# EAGLE design eagle-a31301-breakout-board (EAGLE 9.6.2)
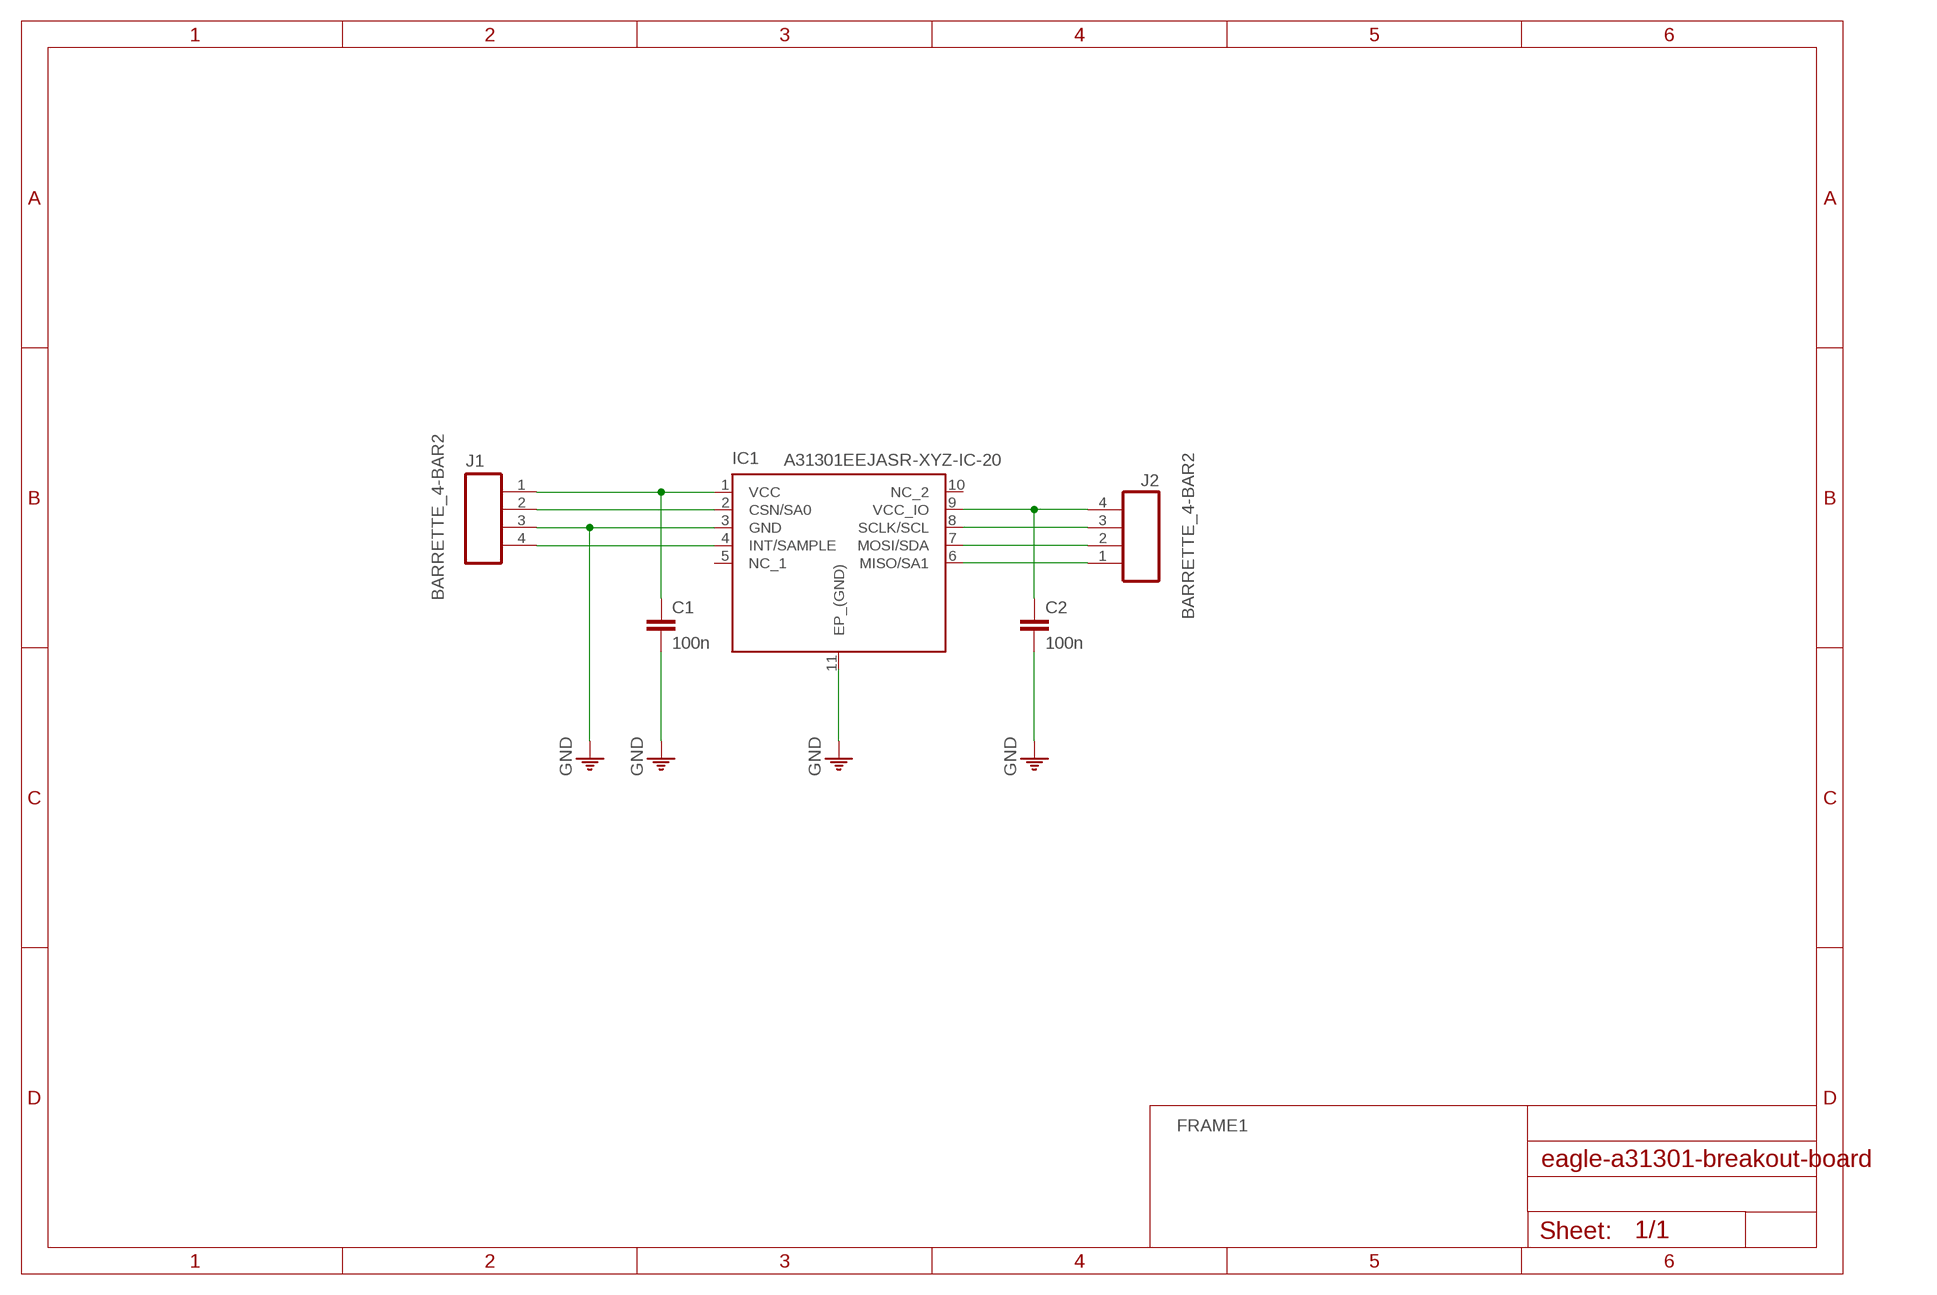
[diagram p0: schematic, sheet 1]

## Parts
C1  100n  C-CMS1206  [CCMS1206]
C2  100n  C-CMS1206  [CCMS1206]
IC1  A31301EEJASR-XYZ-IC-20  [DFN-10]
J1  BARRETTE_4-BAR2  [FE04]
J2  BARRETTE_4-BAR2  [FE04]

## Nets
GND: C1.2 C2.2 IC1.3(GND) IC1.11(EP_(GND)) J1.3
N$1: C1.1 IC1.1(VCC) J1.1
N$2: IC1.2(CSN/SA0) J1.2
N$4: IC1.4(INT/SAMPLE) J1.4
N$5: IC1.6(MISO/SA1) J2.1
N$6: IC1.7(MOSI/SDA) J2.2
N$7: IC1.8(SCLK/SCL) J2.3
N$8: C2.1 IC1.9(VCC_IO) J2.4
Unconnected: IC1.5(NC_1) IC1.10(NC_2)

## Library data of the parts
C1 C2 = 0IUT RLCQ:C: Condensateur non Polarisé, Symbole Européen Voir les valeurs sur site Magasin: http://geii/magasin GEII/IUT ANGERS; MAGASIN: (MAG-CMS)
IC1 = 0IUT xPROJETS:A31301EEJASR-XYZ-IC-20: 3D Linear Hall-Effect Sensor with SPI, I2C Interfaces, and Advanced Low-Power Management Source: Datasheet <https://www.allegromicro.com/en/>; DESCRIPTION: 3D Linear Hall-Effect Sensor with SPI, I2C Interfaces, and Advanced Low-Power Management; HEIGHT: 0.8mm; MANUFACTURER_NAME: Allegro Microsystems; MANUFACTURER_PART_NUMBER: A31301EEJASR-XYZ-IC-20; MOUSER_PART_NUMBER: 250-A31301EEJASRIC20; MOUSER_PRICE-STOCK: https://www.mouser.co.uk/ProductDetail/Allegro-MicroSystems/A31301EEJASR-XYZ-IC-20?qs=ST9lo4GX8V1xABNyek0fqA%3D%3D
J1 J2 = 0IUT CONNECTEURS:BARRETTE_4: Barrette 4 Contacts GEII/IUT ANGERS; MAGASIN: BARRETTES 2 (Tiroirs n°2-8)

## Board
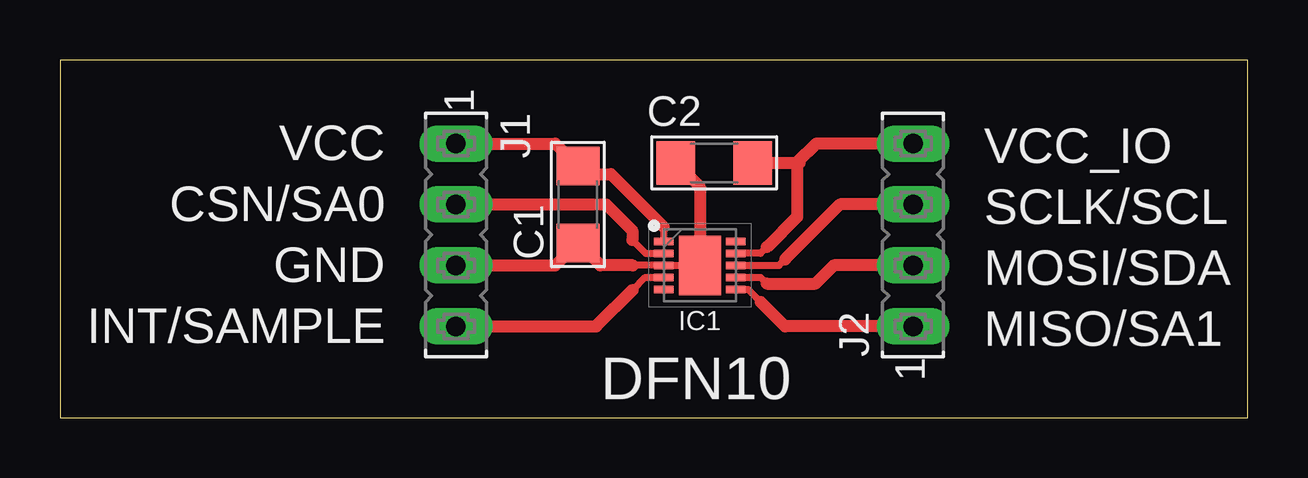
[diagram p1: board, top side]

Size 49.51 x 14.91 mm. Coordinates in mm from the lower left corner, seen from the top.
Outline: 0,0 49.51,0 49.51,14.91 0,14.91 0,0
Copper layers (1*16): Top 0.105mm / dielectric 1.55mm / Bottom 0.105mm
Design rules "default *": minimum track width 0.2mm, minimum drill 0.8mm, track to track 0.2mm, track to pad 0.2mm, pad to pad 0.2mm, via to via 0.2mm, smd to smd 0mil, copper to edge 0mil, drill to drill 0.35mm, minimum pad ring 0.25mm, minimum via ring 0.5mm, stop-mask expansion 0mil, vias tented up to drill 0.45mm, thermal gap 0.2mm

### Footprints (pad centres in the part's own frame; a part is rotated, then mirrored left to right if it is on the bottom)
CCMS1206 = smd 1.6 x 1.803: 1 -1.6,0; 2 1.6,0
DFN-10 = smd 0.8 x 0.3: 1 -1.5,1; 2 -1.5,0.5; 3 -1.5,0; 4 -1.5,-0.5; 5 -1.5,-1; 6 1.5,-1; 7 1.5,-0.5; 8 1.5,0; 9 1.5,0.5; 10 1.5,1 | smd 1.75 x 2.48: 11 0,0
FE04 = drill 0.813 pad 1.524 long: 1 -3.81,0; 2 -1.27,0; 3 1.27,0; 4 3.81,0

### Placement (x,y rotation side)
C1  21.59,8.89 270 top
C2  27.27,10.62 180 top
IC1  26.67,6.35 0 top
J1  16.51,7.62 270 top
J2  35.56,7.62 90 top

### Tracks (layer width: path | path; a pad name or v marks a point on that pad's centre or on a via)
GND
  Top 0.3: IC1.11 IC1.3 23.88,6.35
  Top 0.5: C2.2 26.67,9.62 IC1.11 | 23.88,6.35 22.53,6.35 C1.2 20.65,6.35 J1.3
N$1
  Top 0.3: IC1.1 25.17,7.95
  Top 0.5: 25.17,7.95 22.96,10.16 21.92,10.16 C1.1 20.65,11.43 J1.1
N$2
  Top 0.3: 23.86,7.4 24.41,6.85 IC1.2
  Top 0.5: 23.86,7.4 23.86,7.8 22.77,8.89 J1.2
N$4
  Top 0.3: 23.88,5.33 24.39,5.85 IC1.4
  Top 0.5: 23.88,5.33 22.35,3.81 J1.4
N$5
  Top 0.3: IC1.6 28.69,5.35 29.21,4.83
  Top 0.5: J2.1 30.23,3.81 29.21,4.83
N$6
  Top 0.3: IC1.7 29.2,5.85 29.46,5.59
  Top 0.5: J2.2 32.26,6.35 31.5,5.59 29.46,5.59
N$7
  Top 0.3: IC1.8 29.97,6.35 30.23,6.6
  Top 0.5: J2.3 32.51,8.89 30.23,6.6
N$8
  Top 0.3: 29.46,7.11 29.2,6.85 IC1.9
  Top 0.5: C2.1 30.83,10.62 30.73,10.52 | 29.46,7.11 30.73,8.37 30.73,10.52 | 30.73,10.52 30.73,10.62 31.53,11.43 J2.4

### Text on the board
tPlace: VCC | VCC_IO | CSN/SA0 | SCLK/SCL | GND | MOSI/SDA | INT/SAMPLE | MISO/SA1 | DFN10